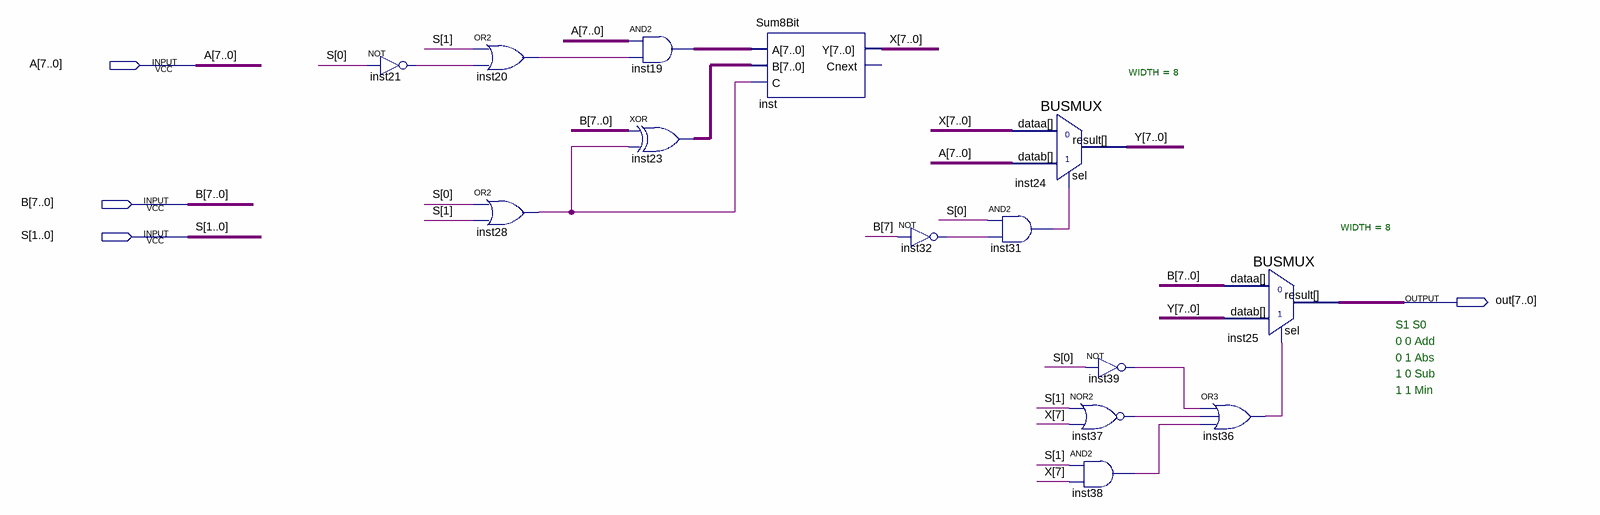
[diagram p0: schematic sheet]
// Quartus schematic AbsMinAddSub.bdf as structural Verilog: 14 symbols, 4 pins
module AbsMinAddSub (
  input  [7:0] A,
  input  [7:0] B,
  input  [1:0] S,
  output [7:0] out
);

  wire inst20_out, inst21_out, inst28_out, inst31_out, inst32_out, inst36_out, inst37_out, inst38_out,
       inst39_out;
  wire [7:0] inst19_out, inst23_out, X, Y;

  not inst21 (inst21_out, S[0]);
  or inst20 (inst20_out, S[1], inst21_out);
  or inst28 (inst28_out, S[0], S[1]);
  assign inst19_out = A & {8{inst20_out}};  // AND2 inst19, 8 bits wide
  assign inst23_out = B ^ {8{inst28_out}};  // XOR inst23, 8 bits wide
  Sum8Bit inst (.A(inst19_out), .B(inst23_out), .C(inst28_out), .Y(X));  // open: Cnext
  not inst32 (inst32_out, B[7]);
  BUSMUX #(.WIDTH(8)) inst24 (.datab(A), .sel(inst31_out), .dataa(X), .result(Y));
  and inst31 (inst31_out, S[0], inst32_out);
  nor inst37 (inst37_out, S[1], X[7]);
  and inst38 (inst38_out, S[1], X[7]);
  not inst39 (inst39_out, S[0]);
  or inst36 (inst36_out, inst39_out, inst37_out, inst38_out);
  BUSMUX #(.WIDTH(8)) inst25 (.datab(Y), .sel(inst36_out), .dataa(B), .result(out));

  // Notes on the sheet:
  //   S1 S0
  //   0 0 Add
  //   0 1 Abs
  //   1 0 Sub
  //   1 1 Min
endmodule
